# Altium schematic sheet #NIP涡轮驱动板-4.SchDoc
size A3
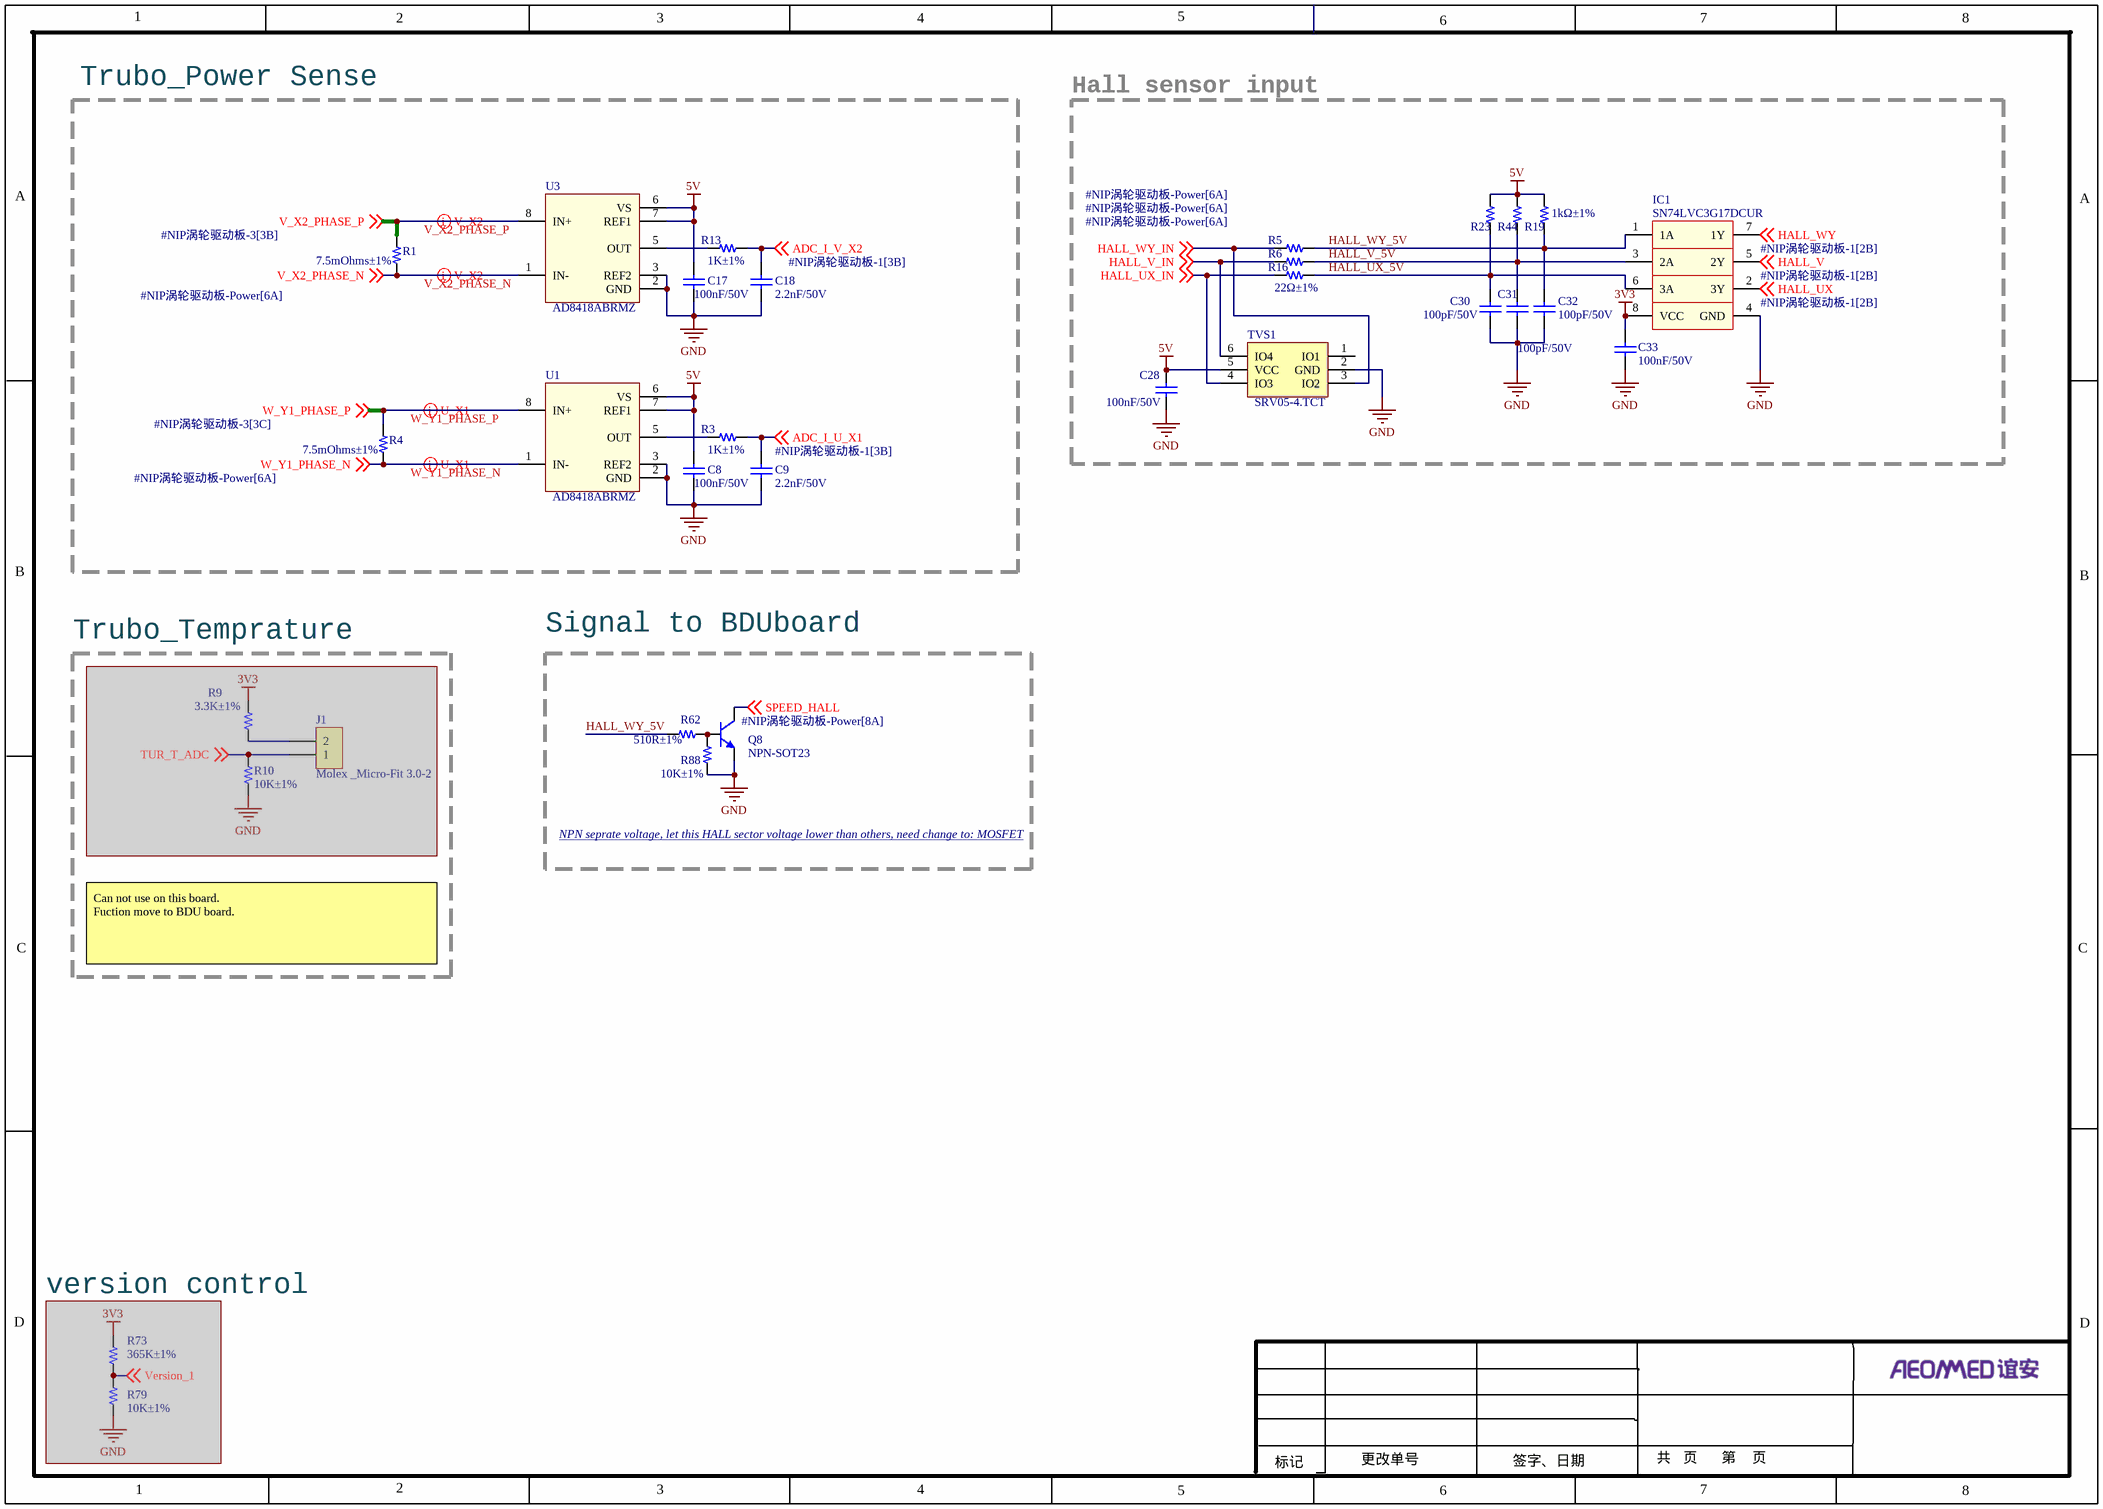
[diagram p0: #NIP涡轮驱动板-4.SchDoc]

## Parts
C8  100nF/50V  [C-0603]
C9  2.2nF/50V  [C-0603]
C17  100nF/50V  [C-0603]
C18  2.2nF/50V  [C-0603]
C28  100nF/50V  [C-0603]
C30  100pF/50V  [C0402]
C31  100pF/50V  [C0402]
C32  100pF/50V  [C0402]
C33  100nF/50V  [C-0603]
IC1  SN74LVC3G17DCUR  [TSSOP50P310X90-8L]
J1  Molex _Micro-Fit 3.0-2  [Molex _Micro-Fit 3.0 2X1]  (masked out: inside a compile mask, not in the netlist)
Q8  NPN-SOT23  [SOT23-3]
R1  7.5mOhms±1%  [R-2512_4PIN]
R3  1K±1%  [R-0603]
R4  7.5mOhms±1%  [R-2512_4PIN]
R5  22Ω±1%  [R0402]  (value not drawn)
R6  22Ω±1%  [R0402]  (value not drawn)
R9  3.3K±1%  [R-0603]  (masked out: inside a compile mask, not in the netlist)
R10  10K±1%  [R-0603]  (masked out: inside a compile mask, not in the netlist)
R13  1K±1%  [R-0603]
R16  22Ω±1%  [R0402]
R19  1kΩ±1%  [R0402]
R23  1kΩ±1%  [R0402]  (value not drawn)
R44  1kΩ±1%  [R0402]  (value not drawn)
R62  510R±1%  [R0402]
R73  365K±1%  [R-0603]  (masked out: inside a compile mask, not in the netlist)
R79  10K±1%  [R-0603]  (masked out: inside a compile mask, not in the netlist)
R88  10K±1%  [R0402]
TVS1  SRV05-4.TCT  [SOT95P280X145-6N]
U1  AD8418ABRMZ  [TSOP65P490X95-8N]
U3  AD8418ABRMZ  [TSOP65P490X95-8N]

## Blocks framed on the sheet
Trubo_Power Sense: C8 C9 C17 C18 R1 R3 R4 R13 U1 U3
Hall sensor input: C28 C30-C33 IC1 R5 R6 R16 R19 R23 R44 TVS1
Trubo_Temprature: J1 R9 R10
Signal to BDUboard: Q8 R62 R88

## Nets
3V3: C33.1 IC1.8(VCC)
5V: C8.2 C17.2 C28.2 R19.2 R23.2 R44.2 TVS1.5(VCC) U1.6(VS) U1.7(REF1) U3.6(VS) U3.7(REF1)
GND: C8.1 C9.1 C17.1 C18.1 C28.1 C30.2 C31.2 C32.2 C33.2 IC1.4(GND) Q8.2(E) R88.2 TVS1.2(GND) U1.2(GND) U1.3(REF2) U3.2(GND) U3.3(REF2)
ADC_I_U_X1: C9.2 R3.1 ; off-sheet ADC_I_U_X1
ADC_I_V_X2: C18.2 R13.1 ; off-sheet ADC_I_V_X2
HALL_UX: IC1.2(3Y) ; off-sheet HALL_UX
HALL_UX_5V: C30.1 IC1.6(3A) R16.2 R23.1
HALL_UX_IN: R16.1 TVS1.4(IO3) ; off-sheet HALL_UX_IN
HALL_V: IC1.5(2Y) ; off-sheet HALL_V
HALL_V_5V: C31.1 IC1.3(2A) R6.2 R44.1
HALL_V_IN: R6.1 TVS1.6(IO4) ; off-sheet HALL_V_IN
HALL_WY: IC1.7(1Y) ; off-sheet HALL_WY
HALL_WY_5V: C32.1 IC1.1(1A) R5.2 R19.1 R62.2
HALL_WY_IN: R5.1 TVS1.3(IO2) ; off-sheet HALL_WY_IN
SPEED_HALL: Q8.3(C) ; off-sheet SPEED_HALL
V_X2_PHASE_N: R1.1 U3.1(IN-) ; off-sheet V_X2_PHASE_N
V_X2_PHASE_P: R1.2 U3.8(IN+) ; off-sheet V_X2_PHASE_P
W_Y1_PHASE_N: R4.1 U1.1(IN-) ; off-sheet W_Y1_PHASE_N
W_Y1_PHASE_P: R4.2 U1.8(IN+) ; off-sheet W_Y1_PHASE_P
NetQ8_1: Q8.1(B) R62.1 R88.1
NetR3_2: R3.2 U1.5(OUT)
NetR13_2: R13.2 U3.5(OUT)

Not connected (* = marked no-connect by the designer): TVS1 1(IO1)

## Layout directives
differential pair: V_X2_PHASE_N, V_X2_PHASE_P, W_Y1_PHASE_N, W_Y1_PHASE_P

## Notes on the sheet
- NPN seprate voltage, let this HALL sector voltage lower than others, need change to: MOSFET
- Can not use on this board.
  Fuction move to BDU board.
- (near R73) version control
- 1
- 2
- 3
- 4
- 5
- 6
- 7
- 8
- A
- B
- C
- D
- 更改单号
- 共   页      第    页
- 标记
- 签字、日期

## Library data of the parts
C8 C9 C17 C18 C28 C30-C33 = C-0603: 物料编号: *; 物料名称: *; 厂家: *; 详细描述: *
IC1 = SN74LVC3G17DCUR: 品牌：TI，型号： 74LVC3G17, 1.65 V to 5.5 V, VSSOP-8，，ROH; MF: TEXAS INSTRUMENTS; MPN: SN74LVC3G17DCUR
J1 = Molex _Micro-Fit 3.0-2: 品牌：Molex,型号：43045-0227，直插，间距3.00，2pin，表面镀锡，ROHS; 名称: 接插件; 物料编号: 43045-0227; 详细描述: 品牌：Molex,型号：43045-0227，直插，间距3.00，2pin，表面镀锡，ROHS; 制造商: Molex
Q8 = NPN-SOT23: 品牌：型号：
R1 R4 = R-2512: PA2512FKF7W7U5E / 7.5mOhms 2W 100PPM/C 1 % 2512
R3 R5 R6 R9 R10 R13 R16 R19 R23 R44 R62 R73 R79 R88 = R-0603
TVS1 = ESD, TVS, SRV05-4.TCT: 品牌：SEMTECH ，型号：SRV05-4.TCT，ROHS; MPN: SRV05-4.TCT; MF: SEMTECH
U1 U3 = AD8418: 品牌：ADI，型号：AD8418ABRMZ，ROHS; Manufacturer: Analog Devices; Id: 50496; Value: CMVR=70V; Part Number: AD8418ABRMZ; Type: DIFAMP; HelpURL: http://www.analog.com/media/en/technical-documentation/data-sheets/AD8418A.pdf